# Altium schematic sheet ArduinoUnoShield.SchDoc
size A4
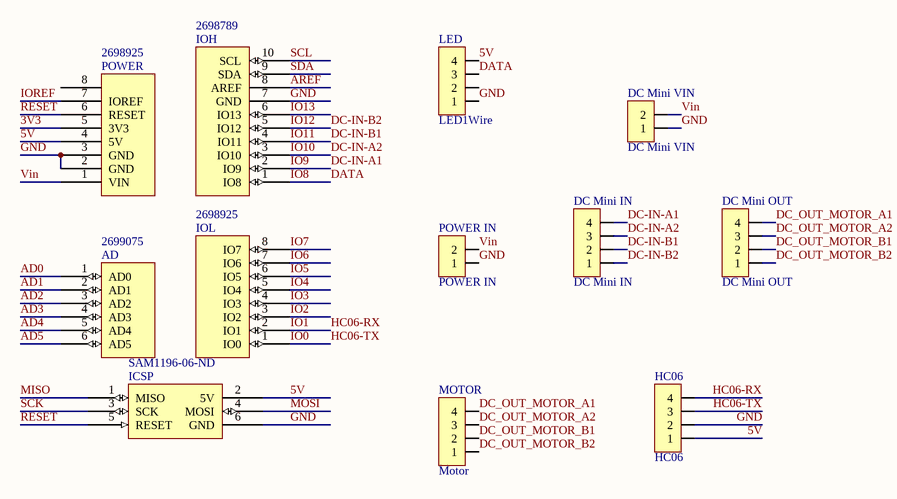
[diagram p0: ArduinoUnoShield.SchDoc]

## Parts
AD  Supplier Part Number 4: 2699075  [Header 6x1 8.5mm]  (hidden comment: AD)
DC_Mini_IN  DC Mini IN  [HDR/Header/4/2mm]
DC_Mini_OUT  DC Mini OUT  [HDR/Header/4/2mm]
DC_Mini_VIN  DC Mini VIN  [HDR/Header/2]
HC06  HC06  [HDR/Header/4/2mm]
ICSP  Supplier Part Number 5: SAM1196-06-ND  [ICSP]  (hidden comment: ICSP)
IOH  Supplier Part Number 3: 2698789  [Header 10x1 8.5mm]  (hidden comment: IOH)
IOL  Supplier Part Number 4: 2698925  [Header 8x1 8.5mm]  (hidden comment: IOL)
LED  LED1Wire  [HDR/Header/4/2mm/BOX]
MOTOR  Motor  [HDR/Terminal/4]
POWER  Supplier Part Number 4: 2698925  [Header 8x1 8.5mm]  (hidden comment: POWER_UNO)
POWER_IN  POWER IN  [HDR/Terminal/2/5mm]

## Nets
3V3: POWER.5(3V3)
5V: HC06.1 ICSP.2(5V) LED.4 POWER.4(5V)
AD0: AD.1(AD0)
AD1: AD.2(AD1)
AD2: AD.3(AD2)
AD3: AD.4(AD3)
AD4: AD.5(AD4)
AD5: AD.6(AD5)
AREF: IOH.8(AREF)
DATA: IOH.1(IO8) LED.3  [also labelled IO8]
DC-IN-A1: DC_Mini_IN.4 IOH.2(IO9)  [also labelled IO9]
DC-IN-A2: DC_Mini_IN.3 IOH.3(IO10)  [also labelled IO10]
DC-IN-B1: DC_Mini_IN.2 IOH.4(IO11)  [also labelled IO11]
DC-IN-B2: DC_Mini_IN.1 IOH.5(IO12)  [also labelled IO12]
DC_OUT_MOTOR_A1: DC_Mini_OUT.4 MOTOR.4
DC_OUT_MOTOR_A2: DC_Mini_OUT.3 MOTOR.3
DC_OUT_MOTOR_B1: DC_Mini_OUT.2 MOTOR.2
DC_OUT_MOTOR_B2: DC_Mini_OUT.1 MOTOR.1
GND: DC_Mini_VIN.1 HC06.2 ICSP.6(GND) IOH.7(GND) LED.1 POWER.2(GND) POWER.3(GND) POWER_IN.1
HC06-RX: HC06.4 IOL.2(IO1)  [also labelled IO1]
HC06-TX: HC06.3 IOL.1(IO0)  [also labelled IO0]
IO2: IOL.3(IO2)
IO3: IOL.4(IO3)
IO4: IOL.5(IO4)
IO5: IOL.6(IO5)
IO6: IOL.7(IO6)
IO7: IOL.8(IO7)
IO13: IOH.6(IO13)
IOREF: POWER.7(IOREF)
MISO: ICSP.1(MISO)
MOSI: ICSP.4(MOSI)
RESET: ICSP.5(RESET) POWER.6(RESET)
SCK: ICSP.3(SCK)
SCL: IOH.10(SCL)
SDA: IOH.9(SDA)
Vin: DC_Mini_VIN.2 POWER.1(VIN) POWER_IN.2

Not connected (* = marked no-connect by the designer): LED 2; POWER 8

## Library data of the parts
DC_Mini_IN DC_Mini_OUT HC06 LED MOTOR = Header 4: Header, 4-Pin
DC_Mini_VIN POWER_IN = Header 2: Header, 2-Pin
AD = AD: Supplier 1: Arrow; Supplier Part Number 1: 2699089; Supplier 2: Digi-Key; Supplier Part Number 2: SAM1198-06-ND; Supplier 3: Arrow; Supplier Part Number 3: 2699088; Supplier 4: Arrow
ICSP = ICSP: Supplier 1: Arrow; Supplier Part Number 1: 2699117; Supplier 2: Arrow; Supplier Part Number 2: 2699116; Supplier 3: Digi-Key; Supplier Part Number 3: SAM1185-06-ND; Supplier 4: Arrow; Supplier Part Number 4: 2699091; Supplier 5: Digi-Key
IOH = IOH: Supplier 1: Arrow; Supplier Part Number 1: 2698803S4475693N1004; Supplier 2: Digi-Key; Supplier Part Number 2: SAM1198-10-ND; Supplier 3: Arrow
IOL = IOL: Supplier 1: Digi-Key; Supplier Part Number 1: SAM1198-08-ND; Supplier 2: Arrow; Supplier Part Number 2: 2698939; Supplier 3: Arrow; Supplier Part Number 3: 2698940; Supplier 4: Arrow
POWER = POWER_UNO: Supplier 1: Digi-Key; Supplier Part Number 1: SAM1198-08-ND; Supplier 2: Arrow; Supplier Part Number 2: 2698939; Supplier 3: Arrow; Supplier Part Number 3: 2698940; Supplier 4: Arrow